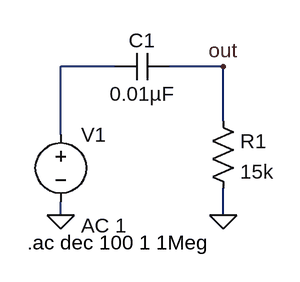
[diagram p0: schematic RCHighPassFilter.asc]
RCHighPassFilter.asc, the LTspice schematic file:
Version 4.1
SHEET 1 880 680
WIRE 144 48 80 48
WIRE 272 48 208 48
WIRE 272 112 272 48
WIRE 80 128 80 48
WIRE 80 224 80 208
WIRE 272 224 272 192
FLAG 272 224 0
FLAG 80 224 0
FLAG 272 48 out
SYMBOL voltage 80 112 R0
WINDOW 123 24 124 Left 2
WINDOW 39 0 0 Left 0
SYMATTR InstName V1
SYMATTR Value ""
SYMATTR Value2 AC 1
SYMBOL cap 208 32 R90
WINDOW 0 0 32 VBottom 2
WINDOW 3 32 32 VTop 2
SYMATTR InstName C1
SYMATTR Value 0.01µF
SYMBOL res 256 96 R0
SYMATTR InstName R1
SYMATTR Value 15k
TEXT 40 256 Left 2 !.ac dec 100 1 1Meg

The netlist it stands for:
* RCHighPassFilter.asc
V1 N001 0 AC 1
C1 out N001 0.01µF
R1 out 0 15k
.ac dec 100 1 1Meg
.backanno
.end